# EAGLE design clock (EAGLE 9.6.2)
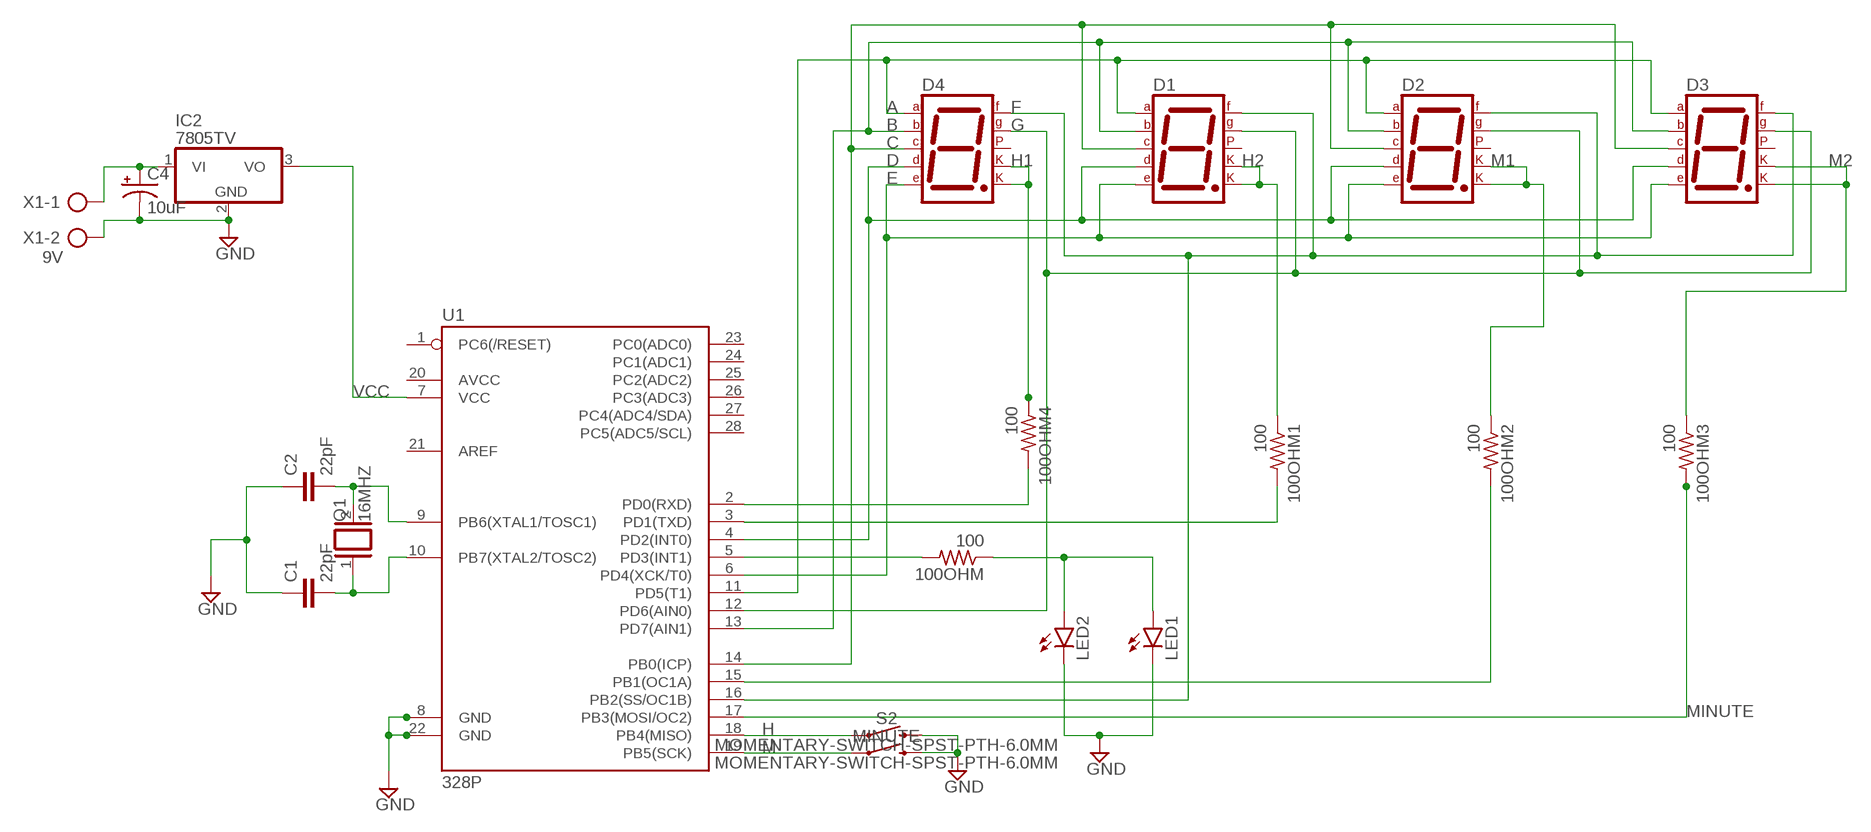
[diagram p0: schematic, sheet 1]

## Parts
100OHM  100  R-US_0207/10  [0207/10]
100OHM1  100  R-US_0207/10  [0207/10]
100OHM2  100  R-US_0207/10  [0207/10]
100OHM3  100  R-US_0207/10  [0207/10]
100OHM4  100  R-US_0207/10  [0207/10]
C1  22pF  22PF-PTH-2.54MM-200V-5%  [CAP-PTH-2.54]
C2  22pF  22PF-PTH-2.54MM-200V-5%  [CAP-PTH-2.54]
C4  10uF  10UF-POLAR-RADIAL-2.5MM-25V-20%  [CPOL-RADIAL-2.5MM-5MM]
D1  7SEG-CK  [7SEG-13]
D2  7SEG-CK  [7SEG-13]
D3  7SEG-CK  [7SEG-13]
D4  7SEG-CK  [7SEG-13]
IC2  7805TV  [TO220V]
LED1  LED5MM  [LED5MM]
LED2  LED5MM  [LED5MM]
MINUTE  MOMENTARY-SWITCH-SPST-PTH-6.0MM  [TACTILE_SWITCH_PTH_6.0MM]
Q1  16MHZ  XTAL/S  [QS]
S2  MOMENTARY-SWITCH-SPST-PTH-6.0MM  [TACTILE_SWITCH_PTH_6.0MM]
U1  328P  ATMEGA328P_PDIP  [DIP28]
X1  9V  AK500/2-H  [AK500/2-H]

## Nets
A: D1.7(A) D2.7(A) D3.7(A) D4.7(A) U1.11(PD5(T1))
B: D1.6(B) D2.6(B) D3.6(B) D4.6(B) U1.13(PD7(AIN1))
C: D1.4(C) D2.4(C) D3.4(C) D4.4(C) U1.14(PB0(ICP))
D: D1.2(D) D2.2(D) D3.2(D) D4.2(D) U1.4(PD2(INT0))
E: D1.1(E) D2.1(E) D3.1(E) D4.1(E) U1.6(PD4(XCK/T0))
F: D1.9(F) D2.9(F) D3.9(F) D4.9(F) U1.16(PB2(SS/OC1B))
G: D1.10(G) D2.10(G) D3.10(G) D4.10(G) U1.12(PD6(AIN0))
GND: C1.1 C2.1 C4.2(-) IC2.2(GND) LED1.K(C) LED2.K(C) MINUTE.3 S2.3 U1.8(GND) U1.22(GND) X1.2
H: S2.1 U1.18(PB4(MISO))
H1: 100OHM4.1 D4.3(CK1) D4.8(CK2)
H2: 100OHM1.1 D1.3(CK1) D1.8(CK2)
LED: 100OHM.1 LED1.A LED2.A
M: MINUTE.1 U1.19(PB5(SCK))
M1: 100OHM2.1 D2.3(CK1) D2.8(CK2)
M2: 100OHM3.1 D3.3(CK1) D3.8(CK2)
MINUTE: 100OHM3.2 U1.17(PB3(MOSI/OC2))
N$5: C2.2 Q1.2 U1.9(PB6(XTAL1/TOSC1))
N$11: 100OHM4.2 U1.2(PD0(RXD))
N$15: C1.2 Q1.1 U1.10(PB7(XTAL2/TOSC2))
N$20: C4.1(+) IC2.1(VI) X1.1
N$25: 100OHM2.2 U1.15(PB1(OC1A))
N$27: 100OHM1.2 U1.3(PD1(TXD))
N$28: 100OHM.2 U1.5(PD3(INT1))
VCC: IC2.3(VO) U1.7(VCC)
Unconnected: D1.5(DP) D2.5(DP) D3.5(DP) D4.5(DP) U1.1(PC6(/RESET)) U1.20(AVCC) U1.21(AREF) U1.23(PC0(ADC0)) U1.24(PC1(ADC1)) U1.25(PC2(ADC2)) U1.26(PC3(ADC3)) U1.27(PC4(ADC4/SDA)) U1.28(PC5(ADC5/SCL))

## Library data of the parts
100OHM 100OHM1-100OHM4 = rcl:R-US_: RESISTOR, American symbol; SPICEPREFIX: R
C1 C2 = With CAD Models:22PF: 22pF ceramic capacitors A capacitor is a passive two-terminal electrical component used to store electrical energy temporarily in an electric field.; PROD_ID: CAP-09128
C4 = With CAD Models:10UF-POLAR: 10.0µF polarized capacitors A capacitor is a passive two-terminal electrical component used to store electrical energy temporarily in an electric field.; PROD_ID: CAP-08440
D1-D4 = special:7SEG-CK: 7-segment DISPLAY single cathode, 13 mm
IC2 = linear:78*: Positive VOLTAGE REGULATOR Source: http://cache.national.com/ds/LM/LM78L05.pdf http://www.fairchildsemi.com/ds/LM/LM7805.pdf
LED1 LED2 = led:LED: LED OSRAM: - CHIPLED LG R971, LG N971, LY N971, LG Q971, LY Q971, LO R971, LY R971 LH N974, LH R974 LS Q976, LO Q976, LY Q976 LO Q996 - Hyper CHIPLED LW Q18S LB Q993, LB Q99A, LB R99A - SideLED LS A670, LO A670, LY A670, LG A670, LP A670 LB A673, LV A673, LT A673, LW A673 LH A674 LY A675 LS A676, LA A676, LO A676, LY A676, LW A676 LS A679, LY A679, LG A679 - Hyper Micro SIDELED® LS Y876, LA Y876, LO Y876, LY Y876 LT Y87S - SmartLED LW L88C, LW L88S LB L89C, LB L89S, LG L890 LS L89K, LO L89K, LY L89K LS L896, LA L896, LO L896, LY L896 - TOPLED LS T670, LO T670, LY T670, LG T670, LP T670 LSG T670, LSP T670, LSY T670, LOP T670, LYG T670 LG T671, LOG T671, LSG T671 LB T673, LV T673, LT T673, LW T673 LH T674 LS T676, LA T676, LO T676, LY T676, LB T676, LH T676, LSB T676, LW T676 LB T67C, LV T67C, LT T67C, LS T67K, LO T67K, LY T67K, LW E67C LS E67B, LA E67B, LO E67B, LY E67B, LB E67C, LV E67C, LT E67C LW T67C LS T679, LY T679, LG T679 LS T770, LO T770, LY T770, LG T770, LP T770 LB T773, LV T773, LT T773, LW T773 LH T774 LS E675, LA E675, LY E675, LS T675 LS T776, LA T776, LO T776, LY T776, LB T776 LHGB T686 LT T68C, LB T68C - Hyper Mini TOPLED® LB M676 - Mini TOPLED Santana® LG M470 LS M47K, LO M47K, LY M47K Source: http://www.osram.convergy.de LUXEON: - LUMILED® LXK2-PW12-R00, LXK2-PW12-S00, LXK2-PW14-U00, LXK2-PW14-V00 LXK2-PM12-R00, LXK2-PM12-S00, LXK2-PM14-U00 LXK2-PE12-Q00, LXK2-PE12-R00, LXK2-PE12-S00, LXK2-PE14-T00, LXK2-PE14-U00 LXK2-PB12-K00, LXK2-PB12-L00, LXK2-PB12-M00, LXK2-PB14-N00, LXK2-PB14-P00, LXK2-PB14-Q00 LXK2-PR12-L00, LXK2-PR12-M00, LXK2-PR14-Q00, LXK2-PR14-R00 LXK2-PD12-Q00, LXK2-PD12-R00, LXK2-PD12-S00 LXK2-PH12-R00, LXK2-PH12-S00 LXK2-PL12-P00, LXK2-PL12-Q00, LXK2-PL12-R00 Source: www.luxeon.com KINGBRIGHT: KA-3528ASYC Source: www.kingbright.com
MINUTE S2 = With CAD Models:MOMENTARY-SWITCH-SPST: Momentary Switch (Pushbutton) - SPST Normally-open (NO) SPST momentary switches (buttons, pushbuttons). Variants PTH-12MM - 12mm square, through-hole Momentary Pushbutton Switch - 12mm Square <https://www.sparkfun.com/products/9190> (COM-09190) PTH-6.0MM, PTH-6.0MM-KIT - 6.0mm square, through-hole Mini Pushbutton Switch <https://www.sparkfun.com/products/97> (COM-00097) KIT package intended for soldering kit's - only one side of pads' copper is exposed. PTH-RIGHT-ANGLE-KIT - Right-angle, through-hole Right Angle Tactile Button <https://www.sparkfun.com/products/10791> - Used on SparkFun BigTime Watch Kit <https://www.sparkfun.com/products/11734> SMD-12MM - 12mm square, surface-mount Tactile Button - SMD (12mm) <https://www.sparkfun.com/products/12993> (COM-12993) Used on SparkFun PicoBoard <https://www.sparkfun.com/products/11888> SMD-4.5MM - 4.5mm Square Trackball Switch Used on SparkFun Blackberry Trackballer Breakout <https://www.sparkfun.com/products/13169> SMD-4.6MMX2.8MM - 4.60mm x 2.80mm, surface mount Used on SparkFun SAMD21 Mini Breakout <https://www.sparkfun.com/products/13664> SMD-5.2MM, SMD-5.2-REDUNDANT - 5.2mm square, surface-mount Mini Pushbutton Switch - SMD <https://www.sparkfun.com/products/8720> (COM-08720) Used on Arduino Pro Mini <https://www.sparkfun.com/products/11114> REDUNDANT package connects both switch circuits together SMD-6.0X3.5MM - 6.0 x 3.5mm, surface mount Momentary Reset Switch SMD <https://www.sparkfun.com/products/8229> (COM-08229) SMD-6.2MM-TALL - 6.2mm square, surface mount Tactile Button - SMD (6mm) <https://www.sparkfun.com/products/12992> Used on SparkFun Digital Sandbox <https://www.sparkfun.com/products/12651> SMD-RIGHT-ANGLE - Right-angle, surface mount Used on SparkFun Block for Intel® Edison - Arduino <https://www.sparkfun.com/products/13036>; PROD_ID: SWCH-08441; SF_SKU: COM-00097
Q1 = special:XTAL/S: CRYSTAL
U1 = With CAD Models:ATMEGA328P_PDIP: Atmel 328P Through hole ATMEGA328P uC used in the Arduino 32kb flash, 1k EEPROM, 2k SRAM Datasheet <http://www.sparkfun.com/datasheets/Components/SMD/ATMega328.pdf> SparkFun Products Storefront component: AVR 28 Pin 20MHz 32K 6A/D - ATMega328P <https://www.sparkfun.com/products/9061> (COM-09061) SparkFun Simon Says - Through-Hole Soldering Kit <https://www.sparkfun.com/products/10547> (KIT-10547) SparkFun Learn to Solder - Simon Says <https://www.sparkfun.com/products/13708> (KIT-13708) SparkFun BigTime Watch Kit <https://www.sparkfun.com/products/11734> (KIT-11734) SparkFun ClockIt <https://www.sparkfun.com/products/10930> (KIT-10930) SparkFun Serial Enabled LCD Kit <https://www.sparkfun.com/products/10097> (LCD-10097) SparkFun Simon Tilts - Through Hole Soldering Kit <https://www.sparkfun.com/products/12634> (KIT-12634) SparkFun Frequency Counter Kit <https://www.sparkfun.com/products/10140> (KIT-10140) FabFM Radio Kit <https://www.sparkfun.com/products/11043> (KIT-11043) SparkFun Binary Blaster Kit <https://www.sparkfun.com/products/12037> (KIT-12037) SparkFun Metro-Gnome <https://www.sparkfun.com/products/9236> (KIT-09236) ATmega328 with Arduino Optiboot (Uno) <https://www.sparkfun.com/products/10524> (DEV-10524); PROD_ID: IC-09136
X1 = With CAD Models:AK500/2-H: CONNECTOR Aug. 2004 / PTR Meßtechnik: Die Bezeichnung der Serie AK505 wurde geändert. Es handelt sich hierbei um AK500 in horizontaler Ausführung.; OC_FARNELL: unknown; OC_NEWARK: unknown

## Board
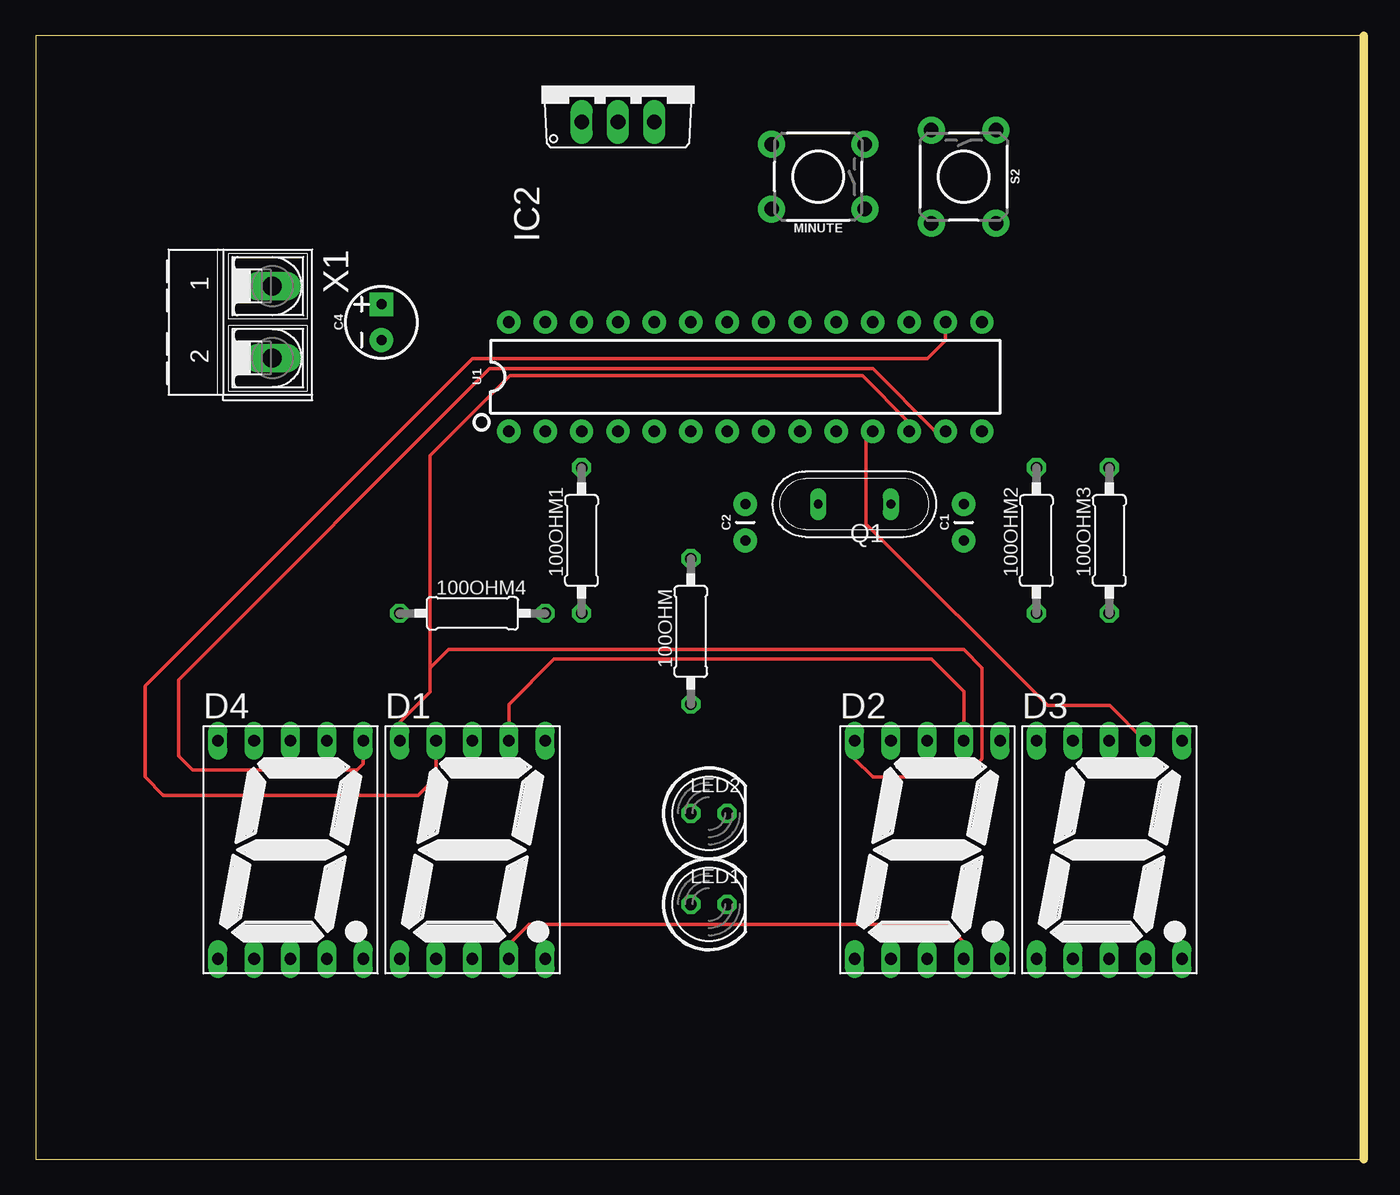
[diagram p1: board, top side]
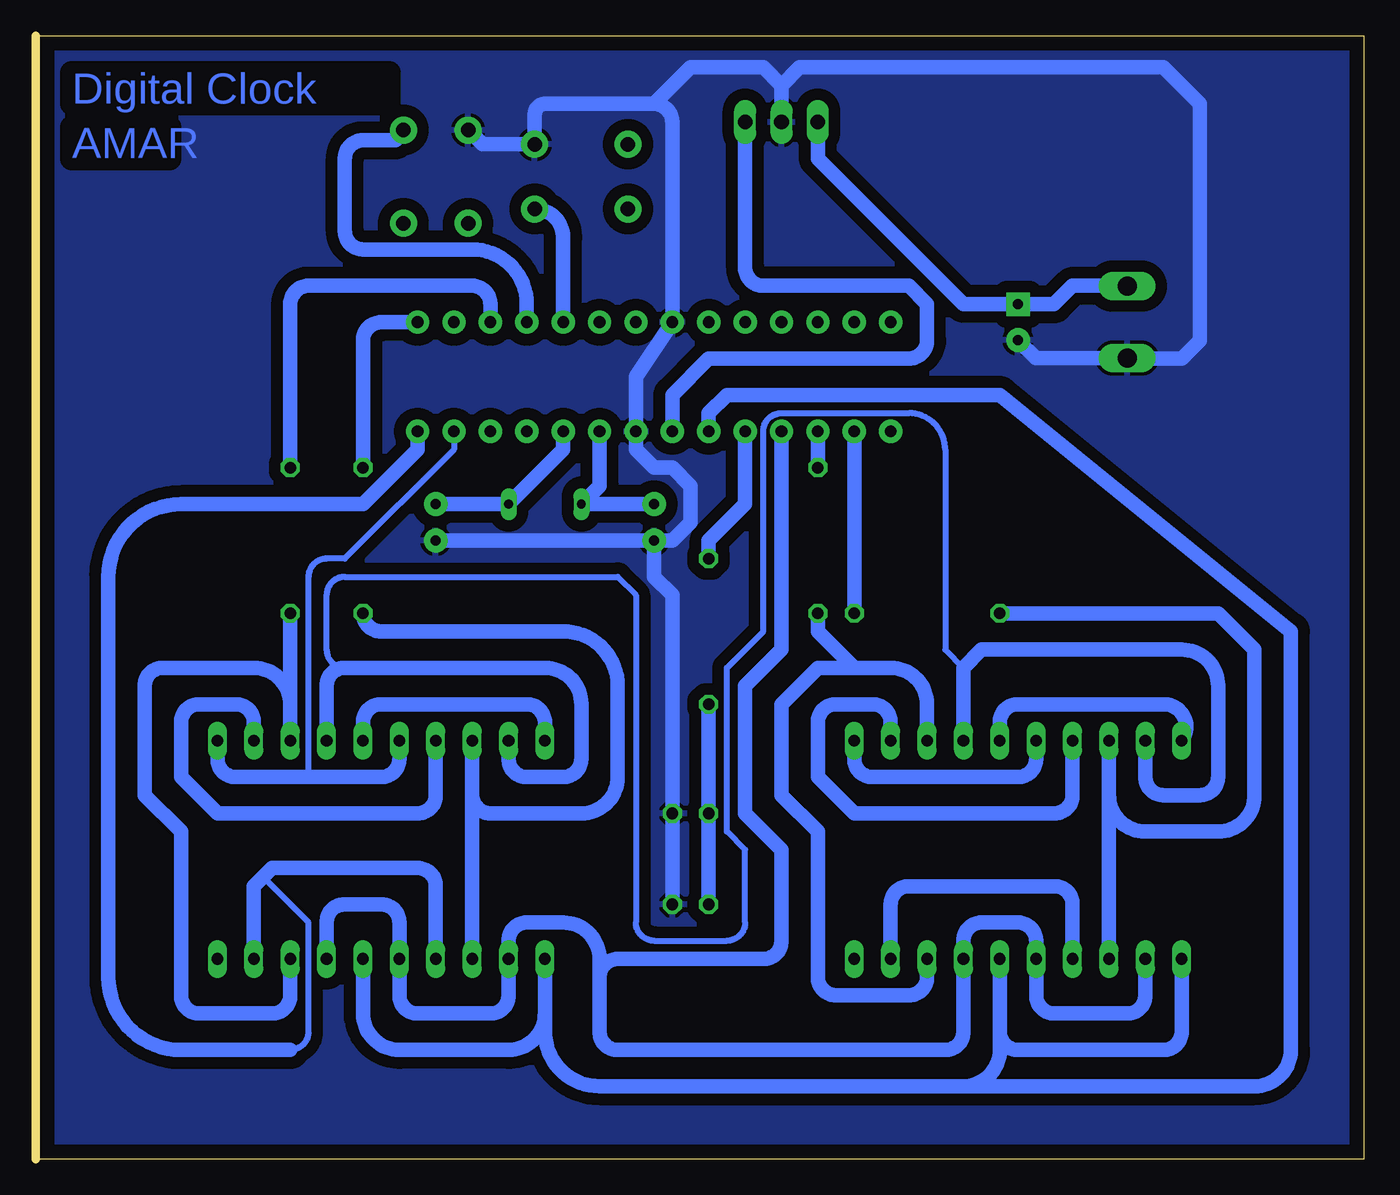
[diagram p2: board, bottom side, seen from below]

Size 92.69 x 78.41 mm. Coordinates in mm from the lower left corner, seen from the top.
Outline: 0,0 92.69,0 92.69,78.41 0,78.41 0,0
Copper layers (1*16): Top 0.035mm / dielectric 1.5mm / Bottom 0.035mm
Design rules "default": minimum track width 10mil, minimum drill 24mil, track to track 8mil, track to pad 8mil, pad to pad 8mil, via to via 8mil, smd to smd 8mil, copper to edge 40mil, drill to drill 8mil, minimum pad ring 10mil, minimum via ring 8mil, stop-mask expansion 4mil, vias tented up to drill 0mil, thermal gap 10mil

### Footprints (pad centres in the part's own frame; a part is rotated, then mirrored left to right if it is on the bottom)
0207/10 = drill 0.813 octagon: 1 -5.08,0; 2 5.08,0
CAP-PTH-2.54 = drill 0.7 pad 1.651: 1 -1.27,0; 2 1.27,0
CPOL-RADIAL-2.5MM-5MM = drill 0.7 pad 1.651 square: 1 1.25,0 | drill 0.7 pad 1.651: 2 -1.25,0
7SEG-13 = drill 0.813 long: 1 -5.08,-7.62; 2 -2.54,-7.62; 3 0,-7.62; 4 2.54,-7.62; 5 5.08,-7.62; 6 5.08,7.62; 7 2.54,7.62; 8 0,7.62; 9 -2.54,7.62; 10 -5.08,7.62
TO220V = drill 1.016 long: 1 -2.54,-2.54; 2 0,-2.54; 3 2.54,-2.54
LED5MM = drill 0.813 octagon: A -1.27,0; K 1.27,0
TACTILE_SWITCH_PTH_6.0MM = drill 1.016 pad 1.88: 1 -3.251,2.261; 2 3.251,2.261; 3 -3.251,-2.261; 4 3.251,-2.261
QS = drill 0.61 long: 1 -2.54,0; 2 2.54,0
DIP28 = drill 0.813 pad 1.626: 1 -16.51,-3.81; 2 -13.97,-3.81; 3 -11.43,-3.81; 4 -8.89,-3.81; 5 -6.35,-3.81; 6 -3.81,-3.81; 7 -1.27,-3.81; 8 1.27,-3.81; 9 3.81,-3.81; 10 6.35,-3.81; 11 8.89,-3.81; 12 11.43,-3.81; 13 13.97,-3.81; 14 16.51,-3.81; 15 16.51,3.81; 16 13.97,3.81; 17 11.43,3.81; 18 8.89,3.81; 19 6.35,3.81; 20 3.81,3.81; 21 1.27,3.81; 22 -1.27,3.81; 23 -3.81,3.81; 24 -6.35,3.81; 25 -8.89,3.81; 26 -11.43,3.81; 27 -13.97,3.81; 28 -16.51,3.81
AK500/2-H = drill 1.321 long: 1 -2.515,0; 2 2.515,0

### Placement (x,y rotation side)
100OHM  45.72,36.83 90 top
100OHM1  38.1,43.18 90 top
100OHM2  69.85,43.18 90 top
100OHM3  74.93,43.18 90 top
100OHM4  30.48,38.1 0 top
C1  64.77,44.45 90 top
C2  49.53,44.45 90 top
C4  24.13,58.42 90 top
D1  30.48,21.59 0 top
D2  62.23,21.59 0 top
D3  74.93,21.59 0 top
D4  17.78,21.59 0 top
IC2  40.64,74.93 0 top
LED1  46.99,17.78 0 top
LED2  46.99,24.13 0 top
MINUTE  54.61,68.58 180 top
Q1  57.15,45.72 180 top
S2  64.77,68.58 270 top
U1  49.53,54.61 0 top
X1  16.51,58.42 270 top

### Tracks (layer width: path | path; a pad name or v marks a point on that pad's centre or on a via)
A
  Top 0.254: U1.11 57.96,50.65 57.96,44.34 70.65,31.65 74.96,31.65 77.46,29.15 D3.7 | D1.7 33.02,31.75 36.19,34.92 62.5,34.92 64.77,32.65 D2.7
  Bottom 1.016: D1.7 33.02,30.48 arc-90 34.29,31.75 36.83,31.75 arc-90 38.1,30.48 38.1,26.67 35.56,24.13 21.59,24.13 arc-90 20.32,25.4 D4.7 | D2.7 64.77,25.4 arc90 66.04,24.13 80.01,24.13 82.55,26.67 82.55,30.48 arc90 81.28,31.75 78.74,31.75 arc90 77.47,30.48 D3.7
B
  Top 0.254: D4.6 22.86,27.59 22.42,27.15 10.95,27.15 9.96,28.14 9.96,33.46 31.69,55.19 58.42,55.19 62.81,50.8 U1.13
  Bottom 0.406: 73.66,26.67 73.66,40.64 arc90 72.39,41.91 71.12,41.91 63.5,49.53 U1.13
  Bottom 1.016: D4.6 22.86,27.94 arc90 24.13,26.67 34.29,26.67 arc90 35.56,27.94 D1.6 | D3.6 80.01,27.94 arc-90 78.74,26.67 73.66,26.67 68.58,26.67 arc-90 67.31,27.94 D2.6
C
  Top 0.254: 32.96,13.65 D1.4 33.02,14.97 34.43,16.38 63.5,16.38 64.77,15.11 D2.4
  Bottom 0.406: 76.83,19.69 73.66,16.51 73.66,8.89 arc90 74.93,7.62
  Bottom 1.016: D4.4 20.32,17.78 arc-90 21.59,19.05 31.75,19.05 arc-90 33.02,17.78 D1.4 | D2.4 64.77,19.05 arc-90 66.04,20.32 76.2,20.32 76.83,19.69 77.47,19.05 D3.4 | 74.93,7.62 82.55,7.62 arc90 87.63,12.7 87.63,40.64 arc90 82.55,45.72 69.85,45.72 66.04,49.53 U1.14
D
  Bottom 1.016: D4.2 15.24,11.43 arc90 16.51,10.16 21.59,10.16 arc90 22.86,11.43 22.86,15.24 arc-90 24.13,16.51 26.67,16.51 arc-90 27.94,15.24 D1.2 27.94,8.89 arc90 29.21,7.62 52.07,7.62 arc90 53.34,8.89 53.34,12.7 | D3.2 72.39,16.51 arc90 71.12,17.78 68.58,17.78 arc90 67.31,16.51 67.31,11.43 arc-90 66.04,10.16 60.96,10.16 arc-90 59.69,11.43 D2.2 59.69,15.24 arc90 58.42,16.51 55.88,16.51 arc90 53.34,13.97 53.34,12.7 | U1.4 40.64,35.56 43.18,33.02 43.18,24.13 40.64,21.59 40.64,15.24 arc90 41.91,13.97 52.07,13.97 arc-90 53.34,12.7
E
  Bottom 1.016: D4.1 12.7,8.89 arc90 13.97,7.62 24.13,7.62 arc90 25.4,8.89 | D3.1 69.85,10.16 arc-90 67.31,7.62 59.69,7.62 arc-90 57.15,10.16 | 27.94,5.08 53.34,5.08 arc90 57.15,8.89 57.15,10.16 | 27.94,5.08 7.62,5.08 arc-90 5.08,7.62 5.08,36.83 25.4,53.34 44.45,53.34 45.72,52.07 U1.6 | D1.1 25.4,8.89 | 25.4,8.89 25.4,7.62 arc90 27.94,5.08 | 57.15,10.16 D2.1
F
  Top 0.254: D1.9 27.94,26.67 26.67,25.4 8.89,25.4 7.62,26.67 7.62,33.02 30.48,55.88 62.23,55.88 63.5,57.15 U1.16
  Bottom 0.406: 27.94,34.29 29.21,35.56 29.21,49.53 arc-90 31.75,52.07 40.64,52.07 arc-90 41.91,50.8 41.91,36.83 44.45,34.29 44.45,22.86 43.18,21.59 43.18,16.51 arc90 44.45,15.24 49.53,15.24 arc90 50.8,16.51 50.8,39.37 52.07,40.64 71.12,40.64 arc-90 72.39,39.37 72.39,35.56 arc-90 71.12,34.29
  Bottom 1.016: D4.9 15.24,26.67 arc-90 13.97,25.4 11.43,25.4 arc-90 10.16,26.67 10.16,33.02 arc-90 12.7,35.56 26.67,35.56 27.94,34.29 D1.9 | D2.9 59.69,27.94 arc-90 58.42,26.67 55.88,26.67 arc-90 54.61,27.94 54.61,31.75 arc-90 57.15,34.29 71.12,34.29 arc-90 72.39,33.02 D3.9
G
  Top 0.254: U1.12 60.96,51.42 57.69,54.69 33.11,54.69 27.53,49.11 27.53,34.29 | D1.10 25.4,30.48 27.53,32.61 27.53,34.29 | D2.10 57.15,27.94 58.42,26.67 64.77,26.67 66.04,27.94 66.04,34.29 64.77,35.56 28.8,35.56 27.53,34.29
  Bottom 1.016: D4.10 arc-127 13.97,31.75 24.13,31.75 arc-90 25.4,30.48 D1.10 | D3.10 69.85,30.48 arc90 68.58,31.75 58.42,31.75 arc90 57.15,30.48 D2.10
GND
  Bottom 1.016: LED1.K LED2.K 48.26,39.37 49.53,40.64 C2.1 | C2.1 C1.1 | 49.53,73.66 57.15,73.66 arc-90 57.86,72.95 MINUTE.3 61.52,70.84 S2.3 | 49.53,73.66 arc90 48.26,72.39 U1.22 50.8,54.61 U1.8 50.8,49.53 49.53,48.26 48.26,48.26 46.99,46.99 46.99,44.45 48.26,43.18 C2.1 | C4.2 24.13,57.15 22.88,55.91 X1.2 16.48,55.88 12.7,55.88 11.43,57.15 11.43,73.66 13.97,76.2 39.37,76.2 40.64,74.93 | IC2.2 40.64,74.93 | 40.64,74.93 41.91,76.2 46.99,76.2 49.53,73.66
  pour Bottom (isolate 0.813): 0,78.74 91.44,78.74 92.71,78.74 92.71,0 0,0 0,77.47
H
  Bottom 1.016: U1.18 58.42,59.69 arc-90 62.23,63.5 69.85,63.5 arc90 71.12,64.77 71.12,69.85 arc90 69.85,71.12 67.59,71.12 S2.1
H1
  Bottom 1.016: D4.3 17.78,25.4 | 17.78,25.4 D4.8 | 100OHM4.1 10.16,38.1 7.62,35.56 7.62,25.4 arc90 10.16,22.86 15.24,22.86 arc90 17.78,25.4
H2
  Bottom 1.016: D1.3 30.48,12.7 arc90 31.75,11.43 36.83,11.43 arc90 38.1,12.7 38.1,22.86 40.64,25.4 40.64,31.75 38.1,34.29 35.56,34.29 | D1.8 30.48,31.75 arc-90 33.02,34.29 35.56,34.29 | 100OHM1.1 38.1,36.83 35.56,34.29
LED
  Bottom 1.016: 100OHM.1 LED2.A LED1.A
M
  Bottom 1.016: U1.19 55.88,64.34 arc-90 MINUTE.1
M1
  Bottom 1.016: D2.3 62.23,25.4 | 62.23,25.4 D2.8 | 100OHM2.1 arc-90 68.58,36.83 55.88,36.83 arc90 52.07,33.02 52.07,26.67 arc90 54.61,24.13 60.96,24.13 arc90 62.23,25.4
M2
  Bottom 1.016: D3.3 74.93,11.43 arc90 76.2,10.16 81.28,10.16 arc90 82.55,11.43 82.55,22.86 85.09,25.4 85.09,33.02 arc90 83.82,34.29 77.47,34.29 arc90 74.93,31.75 | D3.8 74.93,31.75 | 74.93,31.75 100OHM3.1
MINUTE
  Bottom 1.016: 100OHM3.2 74.93,59.69 arc90 73.66,60.96 62.23,60.96 arc90 60.96,59.69 U1.17
N$5
  Bottom 1.016: C2.2 Q1.2 53.34,46.99 U1.9
N$11
  Bottom 1.016: 100OHM4.2 U1.2
N$15
  Bottom 1.016: C1.2 Q1.1 55.88,49.53 U1.10
N$20
  Bottom 1.016: IC2.1 38.1,69.85 27.94,59.69 24.15,59.69 C4.1 21.61,59.67 20.32,60.96 16.53,60.96 X1.1
N$25
  Bottom 1.016: U1.15 68.58,58.42 arc-90 69.85,57.15 100OHM2.2
N$27
  Bottom 1.016: 100OHM1.2 U1.3
N$28
  Bottom 1.016: 100OHM.2 45.72,43.18 43.18,45.72 U1.5
VCC
  Bottom 1.016: U1.7 48.26,53.34 45.72,55.88 31.75,55.88 arc-90 30.48,57.15 30.48,59.69 31.75,60.96 41.91,60.96 arc90 43.18,62.23 IC2.3

### Text on the board
Bottom: Digital Clock | AMAR